# EasyEDA schematic 1-Schematic_LABBOX V3.json
TITLE: LabBox Schematic; REV: 3.0; Date: 2021-04-12; Sheet: 1/1; Drawn By: Adrian Moldovan; Company: FabLab
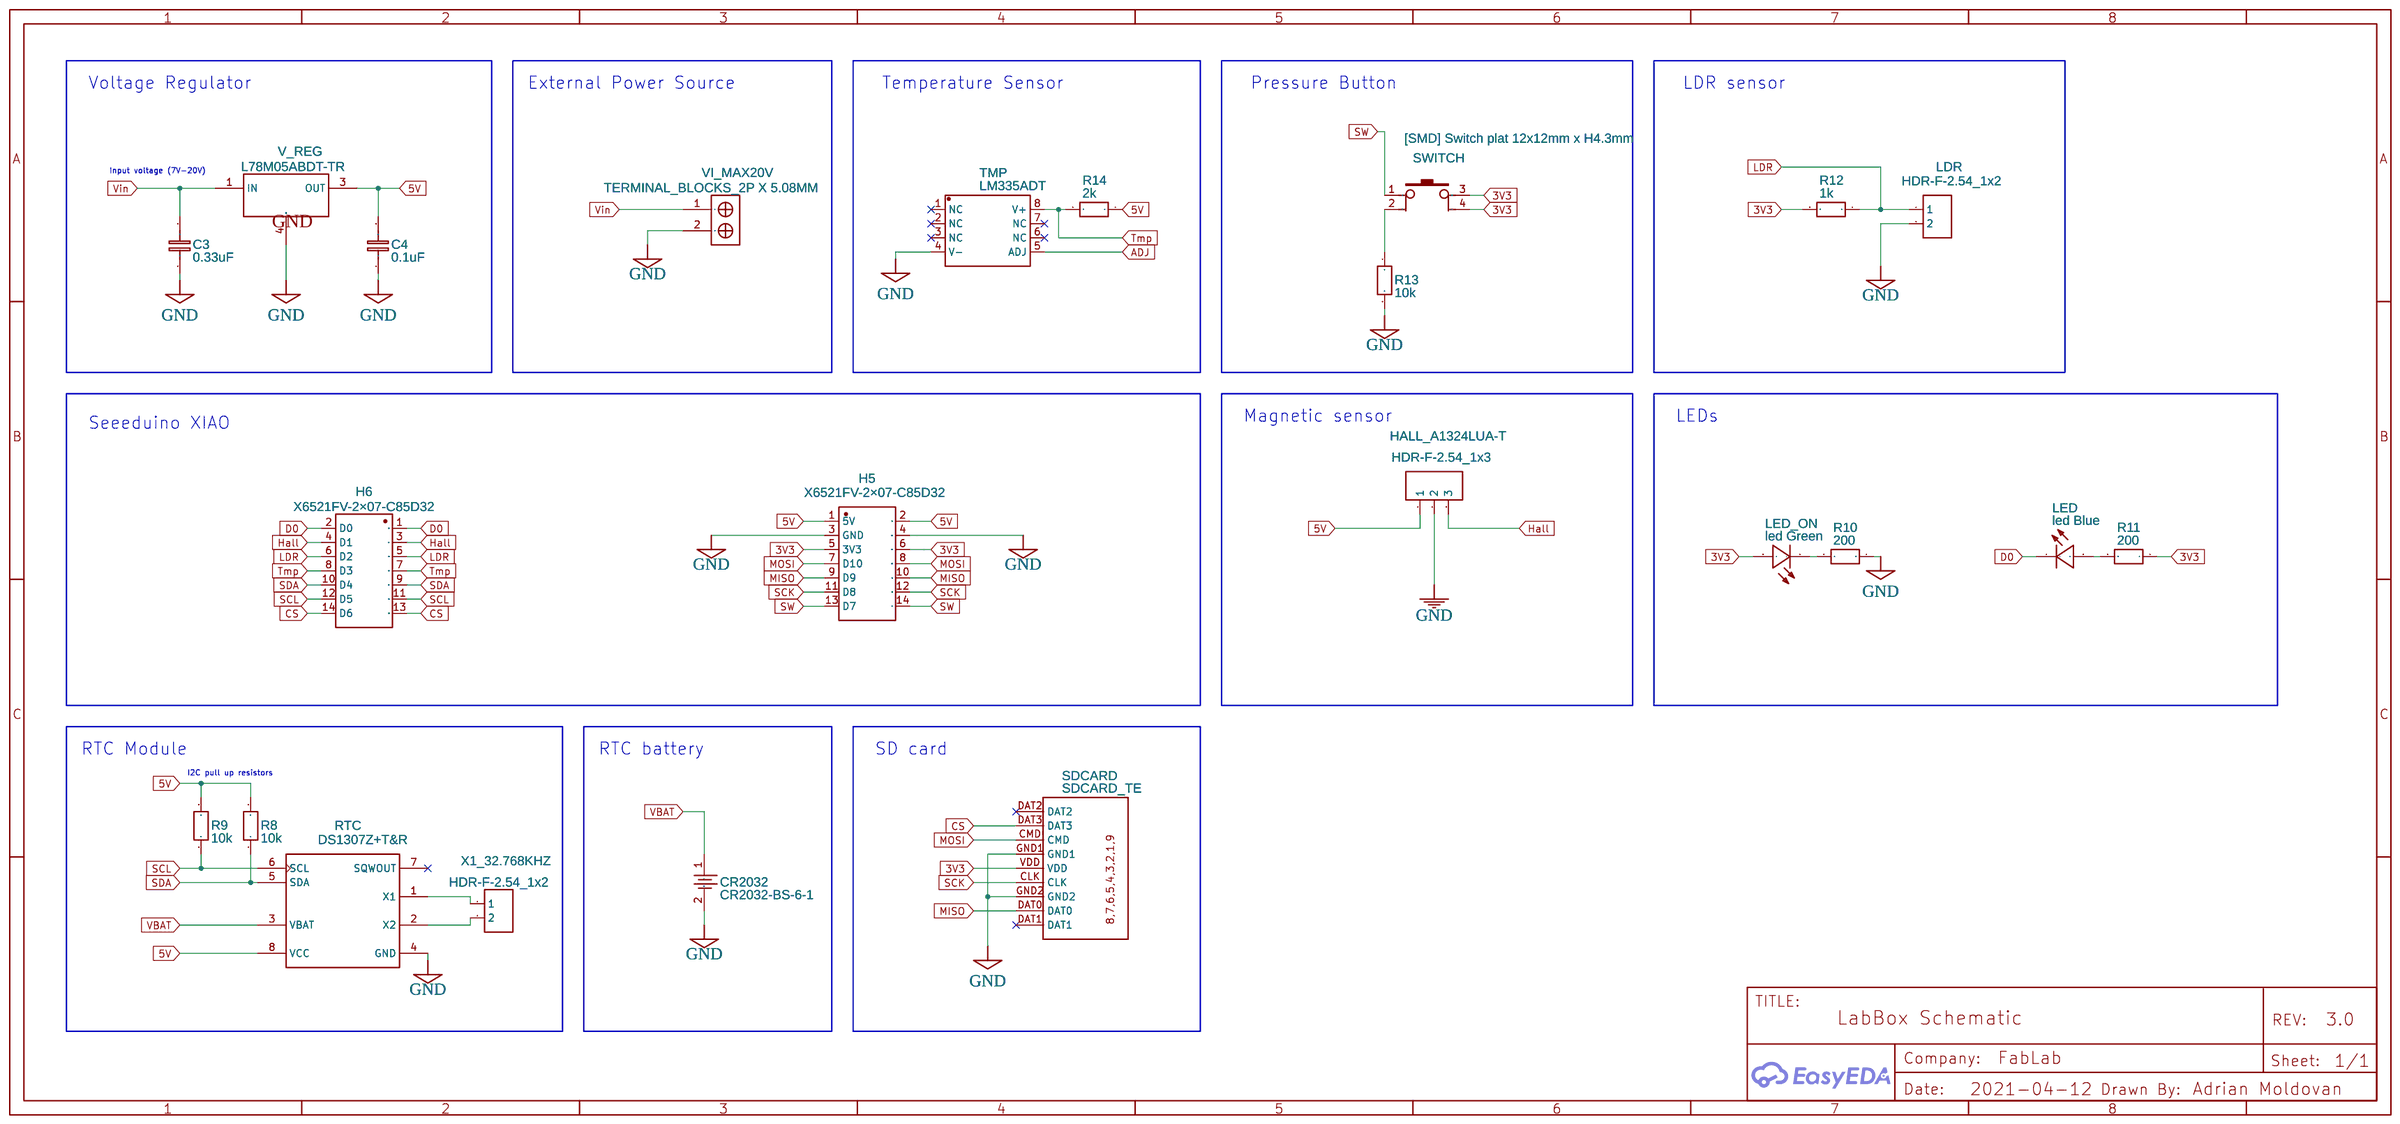
[diagram p0: schematic sheet]

## Parts
C3  0.33uF  [C1206]
C4  0.1uF  [C1206]
CR2032  CR2032-BS-6-1  [BAT-TH_CR2032-BS-6-1]
H5  X6521FV-2×07-C85D32  [HDR-TH_14P-P2.54-V-F-R2-C7-S2.54]
H6  X6521FV-2×07-C85D32  [HDR-TH_14P-P2.54-V-F-R2-C7-S2.54]
HALL_A1324LUA-T  HDR-F-2.54_1x3  [HDR-F-2.54_1X3]
LDR  HDR-F-2.54_1x2  [HDR-F-2.54_1X2]
LED  led Blue  [LED1206-RD]
LED_ON  led Green  [LED1206-RD]
R8  10k  [R1206]
R9  10k  [R1206]
R10  200  [R1206]
R11  200  [R1206]
R12  1k  [R1206]
R13  10k  [R1206]
R14  2k  [R1206]
RTC  DS1307Z+T&R  [SOIC-8_L5.0-W4.0-P1.27-LS6.0-BL]
SDCARD  SDCARD_TE  [SDCARD_TE]
SWITCH  [SMD] Switch plat 12x12mm x H4.3mm  [TACTILE-SMD-12MM]
TMP  LM335ADT  [SOIC-8_L5.0-W4.0-P1.27-LS6.0-BL]
V_REG  L78M05ABDT-TR  [TO-252-2_L6.5-W6.1-P4.58-LS10.0-TL]
VI_MAX20V  TERMINAL_BLOCKS_2P X 5.08MM  [TERMONAL BLOCKS 2P_5,08MM]
X1_32.768KHZ  HDR-F-2.54_1x2  [HDR-F-2.54_1X2]

## Library data of the parts
C3 C4 = C_1206_EU: Contributor: LCEDA_Lib
CR2032 = CR2032-BS-6-1: Supplier: LCSC; Manufacturer: Q&J; image: //image.lceda.cn/szlcsc/C70377.jpg; Supplier Part: C70377; SMT Type: Extend; JLCPCB SMD: Yes; LCSC Assembly: Yes; Paste Type: expand
H5 H6 = X6521FV-2×07-C85D32: Supplier: LCSC; Supplier Part: C718229; Manufacturer: XKB Connectivity; Contributor: LCSC; LCSC Assembly: Yes; SMT Type: Extend; Paste Type: expand
HALL_A1324LUA-T = HDR-F-2.54_1x3: Supplier Part: C146690; Supplier: LCSC; Contributor: LCEDA_Lib
LDR X1_32.768KHZ = HDR-F-2.54_1x2: Supplier Part: C49661; Supplier: LCSC; Contributor: LCEDA_Lib
LED LED_ON = led Green: Supplier: LCSC; Manufacturer: KENTO; image: //image.lceda.cn/szlcsc/C14641.jpg; Supplier Part: C14641; SMT Type: Extend; JLCPCB SMD: Yes; Paste Type: recommend
R8-R14 = R_1206_EU: Contributor: LCEDA_Lib
RTC = DS1307Z+T&amp;amp;R: Supplier: LCSC; Manufacturer: MAXIM; image: //image.lceda.cn/szlcsc/C9868.jpg; Supplier Part: C9868; SMT Type: Extend; JLCPCB SMD: Yes; Paste Type: recommend
SDCARD = SDCARD_TE: Contributor: Elecax
SWITCH = [SMD] Switch plat 12x12mm x H4.3mm: Supplier Part: C410376; Supplier: LCSC; Manufacturer: Hanbo Electronic; Contributor: frederic.vigreux
TMP = LM335ADT: Supplier: LCSC; Supplier Part: C361027; Manufacturer: STMicroelectronics; Contributor: LCSC; SMT Type: Extend; JLCPCB SMD: Yes; LCSC Assembly: Yes; Paste Type: expand
V_REG = L78M05ABDT-TR: Supplier: LCSC; Manufacturer: STMicroelectronics; image: //image.lceda.cn/szlcsc/C58069.jpg; Supplier Part: C58069; SMT Type: Basic; JLCPCB SMD: Yes; LCSC Assembly: Yes; Paste Type: base
VI_MAX20V = TERMINAL_BLOCKS_2P X 5.08MM: Manufacturer Part: Terminal Block; Supplier Part: undefined; Contributor: Mertens

## Nets
3V3: H5.5(3V3) H5.6(3V3) LED_ON.2(+) R11.1 R12.2 SDCARD.VDD SWITCH.3 SWITCH.4
5V: C4.2 H5.1(5V) H5.2(5V) HALL_A1324LUA-T.1 R8.2 R9.2 R14.1 RTC.8(VCC) V_REG.3(OUT)
GND: C3.1 C4.1 CR2032.2 H5.3(GND) H5.4(GND) HALL_A1324LUA-T.2 LDR.2 R10.1 R13.2 RTC.4(GND) SDCARD.GND1 SDCARD.GND2 TMP.4(V-) V_REG.4(GND) VI_MAX20V.2
VBAT: CR2032.1 RTC.3(VBAT)
Vin: C3.2 V_REG.1(IN) VI_MAX20V.1
ADJ: TMP.5(ADJ)
CS: H6.13(D6) H6.14(D6) SDCARD.DAT3
D0: H6.1(D0) H6.2(D0) LED.1(-)
Hall: H6.3(D1) H6.4(D1) HALL_A1324LUA-T.3
LDR: H6.5(D2) H6.6(D2) LDR.1 R12.1
MISO: H5.9(D9) H5.10(D9) SDCARD.DAT0
MOSI: H5.7(D10) H5.8(D10) SDCARD.CMD
SCK: H5.11(D8) H5.12(D8) SDCARD.CLK
SCL: H6.11(D5) H6.12(D5) R9.1 RTC.6(SCL)
SDA: H6.9(D4) H6.10(D4) R8.1 RTC.5(SDA)
SW: H5.13(D7) H5.14 SWITCH.1
Tmp: H6.7(D3) H6.8(D3) R14.2 TMP.8(V+)
Net-(LED-2): LED.2(+) R11.2
Net-(LED_ON-1): LED_ON.1(-) R10.2
Net-(R13-1): R13.1 SWITCH.2
Net-(RTC-1): RTC.1(X1) X1_32.768KHZ.1
Net-(RTC-2): RTC.2(X2) X1_32.768KHZ.2

Not connected (* = marked no-connect by the designer): RTC 7(SQWOUT)*; SDCARD DAT1* DAT2*; TMP 1(NC)* 2(NC)* 3(NC)* 6(NC)* 7(NC)*

## Notes on the sheet
- Voltage Regulator
- External Power Source
- Temperature Sensor
- Pressure Button
- LDR sensor
- Input voltage (7V-20V)
- Seeeduino XIAO
- Magnetic sensor
- LEDs
- RTC Module
- RTC battery
- SD card
- I2C pull up resistors
